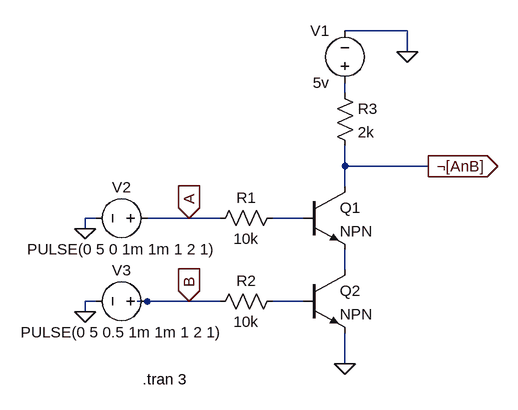
[diagram p0: schematic electronics_bjt_nand_gate2.asc]
electronics_bjt_nand_gate2.asc, the LTspice schematic file:
Version 4
SHEET 1 880 680
WIRE 256 -176 160 -176
WIRE 256 -144 256 -176
WIRE 160 -80 160 -96
WIRE 160 32 160 0
WIRE 288 32 160 32
WIRE 160 64 160 32
WIRE -224 112 -240 112
WIRE -80 112 -144 112
WIRE -32 112 -80 112
WIRE 96 112 48 112
WIRE -240 128 -240 112
WIRE 160 192 160 160
WIRE -224 240 -240 240
WIRE -144 240 -160 240
WIRE -80 240 -144 240
WIRE -32 240 -80 240
WIRE 96 240 48 240
WIRE -240 256 -240 240
WIRE 160 336 160 288
FLAG -80 112 A
IOPIN -80 112 In
FLAG -80 240 B
IOPIN -80 240 In
FLAG 256 -144 0
FLAG 160 336 0
FLAG 288 32 ¬[AnB]
IOPIN 288 32 Out
FLAG -240 128 0
FLAG -240 256 0
SYMBOL npn 96 64 R0
SYMATTR InstName Q1
SYMBOL npn 96 192 R0
SYMATTR InstName Q2
SYMBOL res 64 96 R90
WINDOW 0 0 56 VBottom 2
WINDOW 3 32 56 VTop 2
SYMATTR InstName R1
SYMATTR Value 10k
SYMBOL res 64 224 R90
WINDOW 0 0 56 VBottom 2
WINDOW 3 32 56 VTop 2
SYMATTR InstName R2
SYMATTR Value 10k
SYMBOL res 144 -96 R0
SYMATTR InstName R3
SYMATTR Value 2k
SYMBOL voltage 160 -80 R180
WINDOW 0 24 96 Left 2
WINDOW 3 24 16 Left 2
WINDOW 123 0 0 Left 0
WINDOW 39 0 0 Left 0
SYMATTR InstName V1
SYMATTR Value 5v
SYMBOL voltage -128 112 R90
WINDOW 0 -32 56 VBottom 2
WINDOW 3 32 56 VTop 2
WINDOW 123 0 0 Left 0
WINDOW 39 0 0 Left 0
SYMATTR InstName V2
SYMATTR Value PULSE(0 5 0 1m 1m 1 2 1)
SYMBOL voltage -128 240 R90
WINDOW 0 -32 56 VBottom 2
WINDOW 3 32 56 VTop 2
WINDOW 123 0 0 Left 0
WINDOW 39 0 0 Left 0
SYMATTR InstName V3
SYMATTR Value PULSE(0 5 0.5 1m 1m 1 2 1)
TEXT -152 360 Left 2 !.tran 3

The netlist it stands for:
* electronics_bjt_nand_gate2.asc
Q1 ¬[AnB] N002 N003 0 NPN
Q2 N003 N004 0 0 NPN
R1 N002 A 10k
R2 N004 B 10k
R3 N001 ¬[AnB] 2k
V1 N001 0 5v
V2 A 0 PULSE(0 5 0 1m 1m 1 2 1)
V3 B 0 PULSE(0 5 0.5 1m 1m 1 2 1)
.model NPN NPN
.model PNP PNP
.lib standard.bjt
.tran 3
.backanno
.end